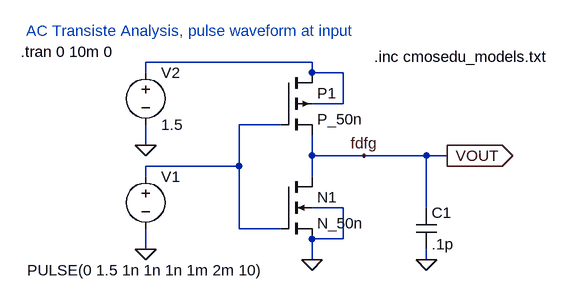
[diagram p0: schematic CMOS_Inv1.asc]
CMOS_Inv1.asc, the LTspice schematic file:
Version 4.1
SHEET 1 880 680
WIRE 176 48 -80 48
WIRE -80 64 -80 48
WIRE 176 64 176 48
WIRE 224 64 176 64
WIRE 176 80 176 64
WIRE 224 112 224 64
WIRE 224 112 176 112
WIRE 128 144 64 144
WIRE -80 176 -80 144
WIRE 176 192 176 160
WIRE 256 192 176 192
WIRE 352 192 256 192
WIRE 384 192 352 192
WIRE 64 208 64 144
WIRE 64 208 -80 208
WIRE -80 224 -80 208
WIRE 176 224 176 192
WIRE 224 272 176 272
WIRE 352 272 352 192
WIRE 64 304 64 208
WIRE 128 304 64 304
WIRE 224 320 224 272
WIRE 224 320 176 320
WIRE -80 336 -80 304
WIRE 176 352 176 320
WIRE 352 352 352 336
FLAG -80 336 0
FLAG 176 352 0
FLAG -80 176 0
FLAG 352 352 0
FLAG 384 192 VOUT
IOPIN 384 192 Out
FLAG 256 192 fdfg
SYMBOL pmos4 128 64 R0
SYMATTR InstName P1
SYMATTR Value P_50n
SYMBOL nmos4 128 224 R0
SYMATTR InstName N1
SYMATTR Value N_50n
SYMBOL voltage -80 208 R0
WINDOW 3 -182 160 Left 2
WINDOW 123 0 0 Left 0
WINDOW 39 0 0 Left 0
SYMATTR Value PULSE(0 1.5 1n 1n 1n 1m 2m 10)
SYMATTR InstName V1
SYMBOL voltage -80 48 R0
WINDOW 123 0 0 Left 0
WINDOW 39 0 0 Left 0
SYMATTR InstName V2
SYMATTR Value 1.5
SYMBOL cap 336 272 R0
SYMATTR InstName C1
SYMATTR Value .1p
TEXT 272 40 Left 2 !.inc cmosedu_models.txt
TEXT -264 0 Left 2 ;AC Transiste Analysis, pulse waveform at input
TEXT -272 32 Left 2 !.tran 0 10m 0

The netlist it stands for:
* CMOS_Inv1.asc
M§P1 N001 N002 fdfg N001 P_50n
M§N1 fdfg N002 0 0 N_50n
V1 N002 0 PULSE(0 1.5 1n 1n 1n 1m 2m 10)
V2 N001 0 1.5
C1 fdfg 0 .1p
.model NMOS NMOS
.model PMOS PMOS
.lib standard.mos
.inc cmosedu_models.txt
* AC Transiste Analysis, pulse waveform at input
.tran 0 10m 0
.backanno
.end